# EAGLE schematic BSS_T10 Underboard component design (EAGLE 6.5.0)
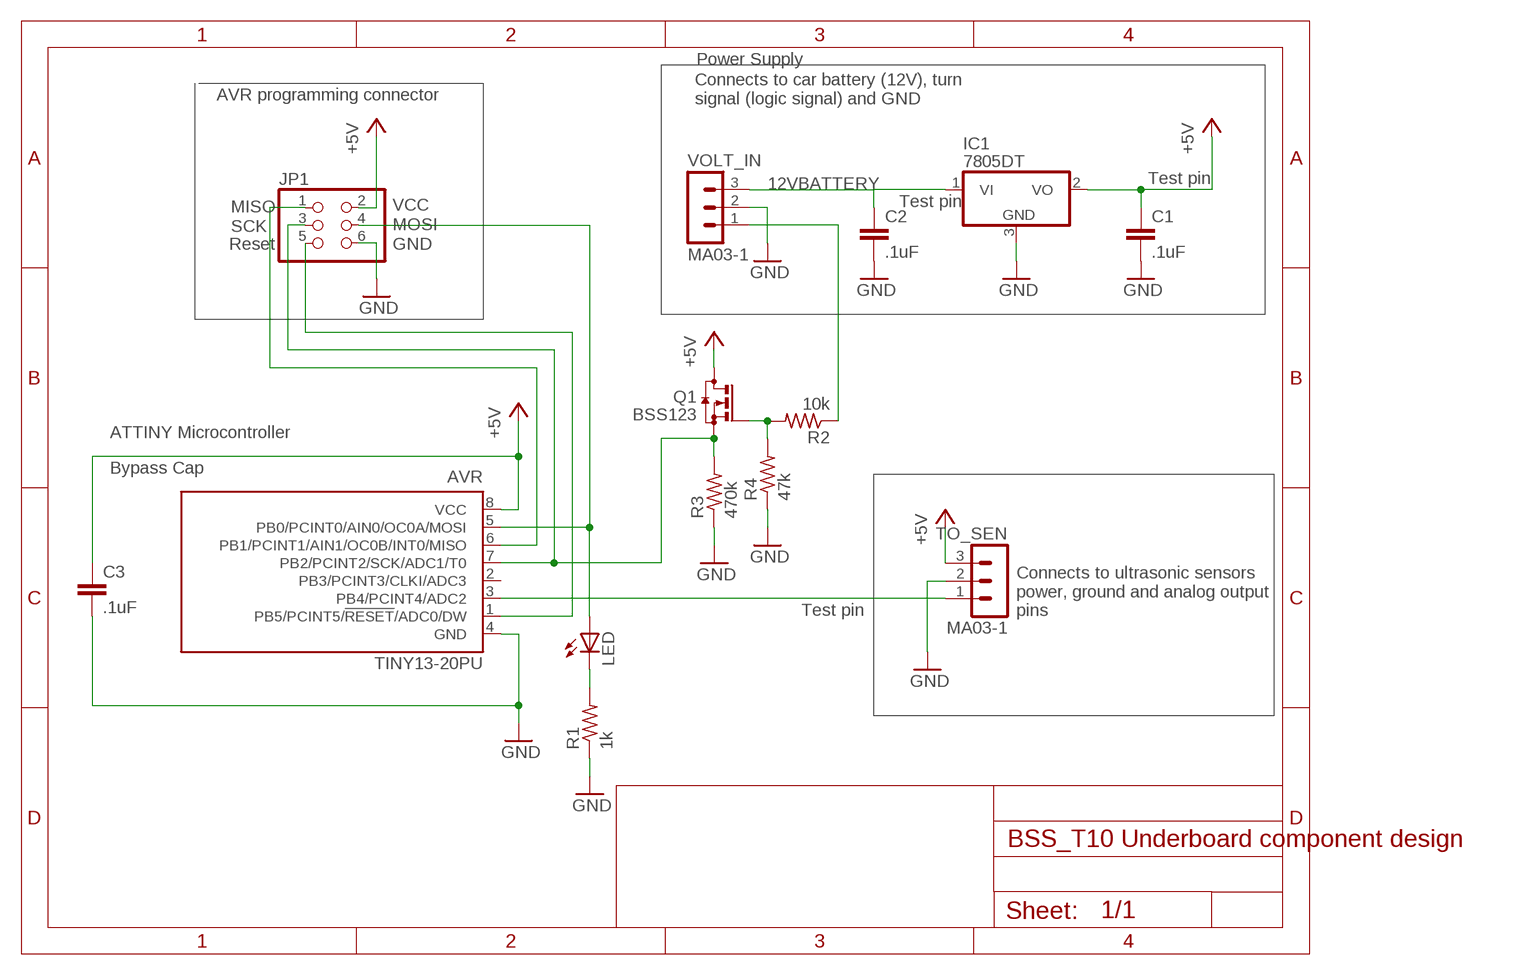
[diagram p0: schematic, sheet 1]

## Parts
AVR  TINY13-20PU  [DIL08]
C1  .1uF  C-EUC0805  [C0805]
C2  .1uF  C-EUC0805  [C0805]
C3  .1uF  C-EUC0805  [C0805]
IC1  7805DT  [TO252]
JP1  PINHD-2X3  [2X03]
LED  LED5MM  [LED5MM]
Q1  BSS123  [SOT23]
R1  1k  R-US_R0805  [R0805]
R2  10k  R-US_R0805  [R0805]
R3  470k  R-US_R0805  [R0805]
R4  47k  R-US_R0805  [R0805]
TO_SEN  MA03-1  [MA03-1]
VOLT_IN  MA03-1  [MA03-1]

## Nets
2N7000: AVR.7(PB2/PCINT2/SCK/ADC1/T0) JP1.3 Q1.2(S) R3.2
12VBATTERY: C2.1 IC1.1(VI) VOLT_IN.3
+5V: AVR.8(VCC) C1.1 C3.1 IC1.2(VO) JP1.2 Q1.3(D) TO_SEN.3
GND: AVR.4(GND) C1.2 C2.2 C3.2 IC1.3(GND) JP1.6 R1.1 R3.1 R4.1 TO_SEN.2 VOLT_IN.2
N$1: AVR.3(PB4/PCINT4/ADC2) TO_SEN.1
N$4: AVR.5(PB0/PCINT0/AIN0/OC0A/MOSI) JP1.4 LED.A
N$5: R2.1 VOLT_IN.1
N$6: Q1.1(G) R2.2 R4.2
N$7: AVR.1(PB5/PCINT5/!RESET!/ADC0/DW) JP1.5
N$9: AVR.6(PB1/PCINT1/AIN1/OC0B/INT0/MISO) JP1.1
RLED: LED.K(C) R1.2
Unconnected: AVR.2(PB3/PCINT3/CLKI/ADC3)

## Notes on the sheet
- Power Supply
- AVR programming connector
- Connects to car battery (12V), turn 
  signal (logic signal) and GND
- Test pin
- VCC | Test pin
- MISO
- SCK | MOSI
- Reset | GND
- ATTINY Microcontroller
- Bypass Cap
- Test pin
- Connects to ultrasonic sensors 
  power, ground and analog output 
  pins

## Library data of the parts
AVR = atmel:TINY13: 8-bit AVR Microcontroller with 1K Bytes In-System Programmable Flash Source: http://www.atmel.com/dyn/resources/prod_documents/2535S.pdf; MPN: ATTINY13-20PU; OC_FARNELL: 9171550; OC_NEWARK: 96K6521
C1-C3 = rcl:C-EU: CAPACITOR, European symbol
IC1 = linear:78*: Positive VOLTAGE REGULATOR Source: http://cache.national.com/ds/LM/LM78L05.pdf http://www.fairchildsemi.com/ds/LM/LM7805.pdf
JP1 = pinhead:PINHD-2X3: PIN HEADER
LED = led:LED: LED OSRAM: - CHIPLED LG R971, LG N971, LY N971, LG Q971, LY Q971, LO R971, LY R971 LH N974, LH R974 LS Q976, LO Q976, LY Q976 LO Q996 - Hyper CHIPLED LW Q18S LB Q993, LB Q99A, LB R99A - SideLED LS A670, LO A670, LY A670, LG A670, LP A670 LB A673, LV A673, LT A673, LW A673 LH A674 LY A675 LS A676, LA A676, LO A676, LY A676, LW A676 LS A679, LY A679, LG A679 - Hyper Micro SIDELED® LS Y876, LA Y876, LO Y876, LY Y876 LT Y87S - SmartLED LW L88C, LW L88S LB L89C, LB L89S, LG L890 LS L89K, LO L89K, LY L89K LS L896, LA L896, LO L896, LY L896 - TOPLED LS T670, LO T670, LY T670, LG T670, LP T670 LSG T670, LSP T670, LSY T670, LOP T670, LYG T670 LG T671, LOG T671, LSG T671 LB T673, LV T673, LT T673, LW T673 LH T674 LS T676, LA T676, LO T676, LY T676, LB T676, LH T676, LSB T676, LW T676 LB T67C, LV T67C, LT T67C, LS T67K, LO T67K, LY T67K, LW E67C LS E67B, LA E67B, LO E67B, LY E67B, LB E67C, LV E67C, LT E67C LW T67C LS T679, LY T679, LG T679 LS T770, LO T770, LY T770, LG T770, LP T770 LB T773, LV T773, LT T773, LW T773 LH T774 LS E675, LA E675, LY E675, LS T675 LS T776, LA T776, LO T776, LY T776, LB T776 LHGB T686 LT T68C, LB T68C - Hyper Mini TOPLED® LB M676 - Mini TOPLED Santana® LG M470 LS M47K, LO M47K, LY M47K Source: http://www.osram.convergy.de LUXEON: - LUMILED® LXK2-PW12-R00, LXK2-PW12-S00, LXK2-PW14-U00, LXK2-PW14-V00 LXK2-PM12-R00, LXK2-PM12-S00, LXK2-PM14-U00 LXK2-PE12-Q00, LXK2-PE12-R00, LXK2-PE12-S00, LXK2-PE14-T00, LXK2-PE14-U00 LXK2-PB12-K00, LXK2-PB12-L00, LXK2-PB12-M00, LXK2-PB14-N00, LXK2-PB14-P00, LXK2-PB14-Q00 LXK2-PR12-L00, LXK2-PR12-M00, LXK2-PR14-Q00, LXK2-PR14-R00 LXK2-PD12-Q00, LXK2-PD12-R00, LXK2-PD12-S00 LXK2-PH12-R00, LXK2-PH12-S00 LXK2-PL12-P00, LXK2-PL12-Q00, LXK2-PL12-R00 Source: www.luxeon.com KINGBRIGHT: KA-3528ASYC Source: www.kingbright.com
Q1 = transistor-small-signal:BSS123: N-CHANNEL MOS FET
R1-R4 = rcl:R-US_: RESISTOR, American symbol
TO_SEN VOLT_IN = con-lstb:MA03-1: PIN HEADER; OC_FARNELL: unknown; OC_NEWARK: unknown